# EAGLE design 1uO_c_v_1_3 (EAGLE 9.4.2)
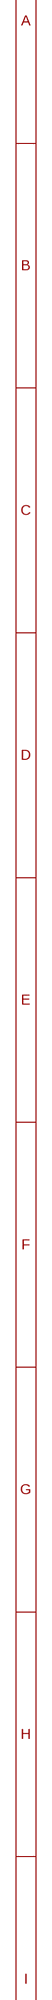
[diagram p0: schematic, sheet 1, part 1 of 2]
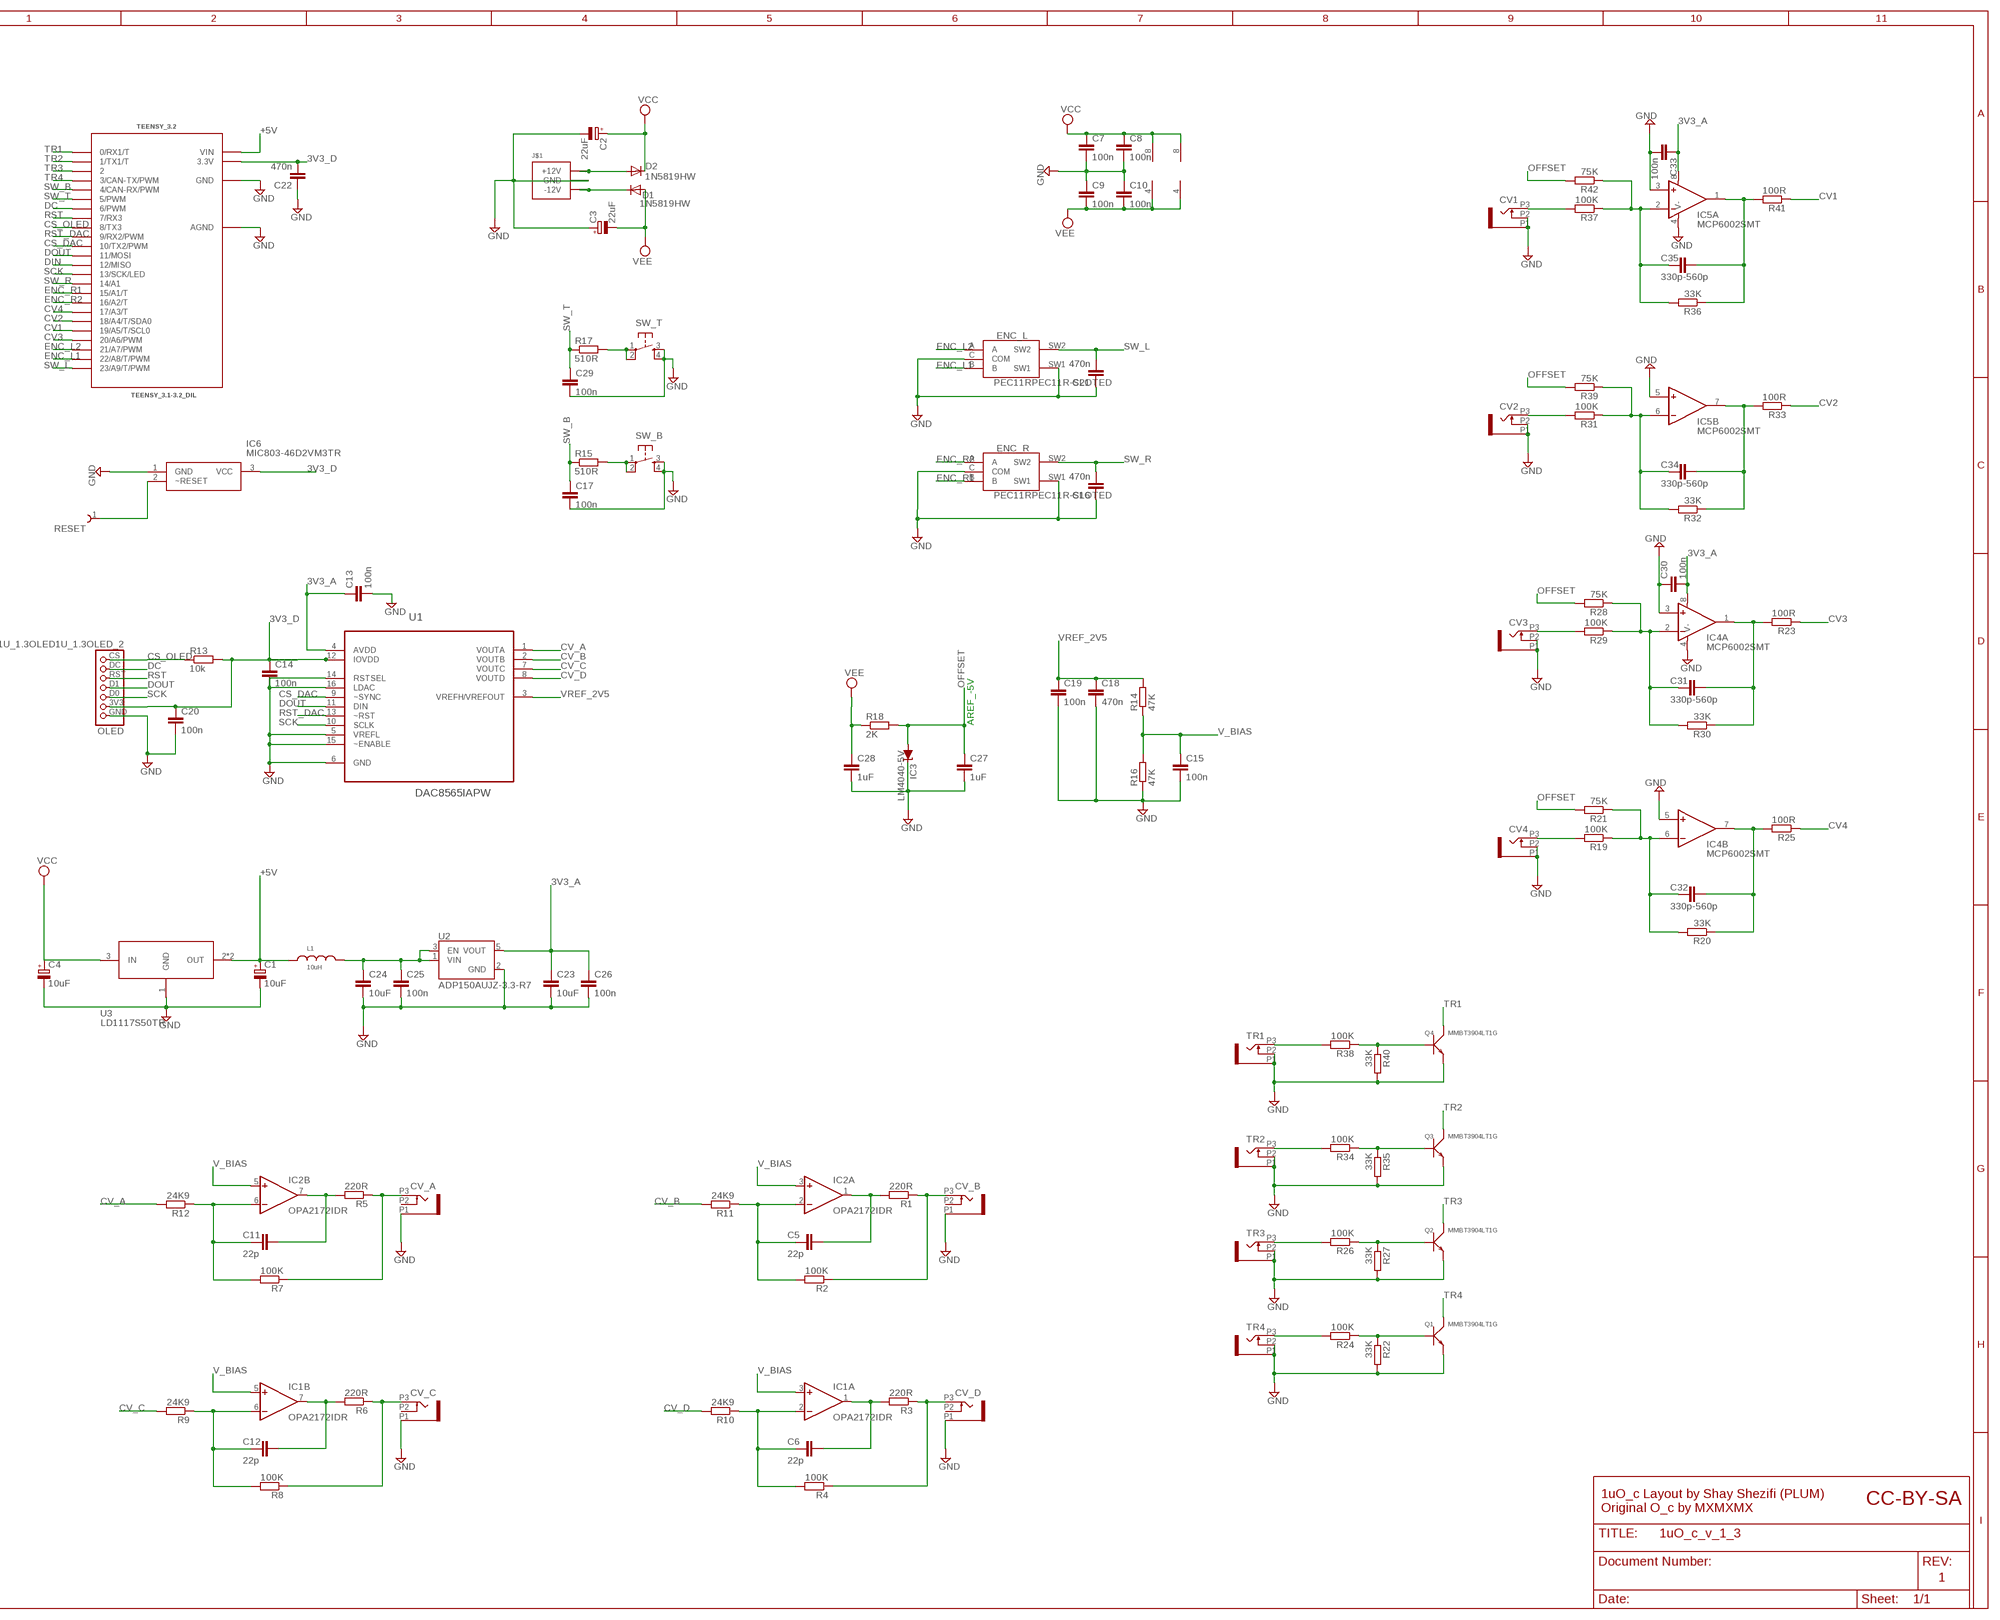
[diagram p1: schematic, sheet 1, part 2 of 2]

## Parts
C1  10uF  CPOL-EUB  [PANASONIC_B]
C2  22uF  CPOL-EUC  [PANASONIC_C]
C3  22uF  CPOL-EUC  [PANASONIC_C]
C4  10uF  CPOL-EUB  [PANASONIC_B]
C5  22p  C-EUC0603  [C0603]
C6  22p  C-EUC0603  [C0603]
C7  100n  C-EUC0603  [C0603]
C8  100n  C-EUC0603  [C0603]
C9  100n  C-EUC0603  [C0603]
C10  100n  C-EUC0603  [C0603]
C11  22p  C-EUC0603  [C0603]
C12  22p  C-EUC0603  [C0603]
C13  100n  C-EUC0603  [C0603]
C14  100n  C-EUC0603  [C0603]
C15  100n  C-EUC0603  [C0603]
C16  470n  C-EUC0603  [C0603]
C17  100n  C-EUC0603  [C0603]
C18  470n  C-EUC0603  [C0603]
C19  100n  C-EUC0603  [C0603]
C20  100n  C-EUC0603  [C0603]
C21  470n  C-EUC0603  [C0603]
C22  470n  C-EUC0603  [C0603]
C23  10uF  C-EUC1206K  [C1206K]
C24  10uF  C-EUC1206K  [C1206K]
C25  100n  C-EUC0603  [C0603]
C26  100n  C-EUC0603  [C0603]
C27  1uF  C-EUC0603  [C0603]
C28  1uF  C-EUC0603  [C0603]
C29  100n  C-EUC0603  [C0603]
C30  100n  C-EUC0603  [C0603]
C31  330p-560p  C-EUC0603  [C0603]
C32  330p-560p  C-EUC0603  [C0603]
C33  100n  C-EUC0603  [C0603]
C34  330p-560p  C-EUC0603  [C0603]
C35  330p-560p  C-EUC0603  [C0603]
CV1  OG-PJ301_PJ301_THONKICONN  [OG-PJ301_WQP_PJ_301M6_NO_HOLE]
CV2  OG-PJ301_PJ301_THONKICONN  [OG-PJ301_WQP_PJ_301M6_NO_HOLE]
CV3  OG-PJ301_PJ301_THONKICONN  [OG-PJ301_WQP_PJ_301M6_NO_HOLE]
CV4  OG-PJ301_PJ301_THONKICONN  [OG-PJ301_WQP_PJ_301M6_NO_HOLE]
CV_A  OG-PJ301_PJ301_THONKICONN  [OG-PJ301_WQP_PJ_301M6_NO_HOLE]
CV_B  OG-PJ301_PJ301_THONKICONN  [OG-PJ301_WQP_PJ_301M6_NO_HOLE]
CV_C  OG-PJ301_PJ301_THONKICONN  [OG-PJ301_WQP_PJ_301M6_NO_HOLE]
CV_D  OG-PJ301_PJ301_THONKICONN  [OG-PJ301_WQP_PJ_301M6_NO_HOLE]
D1  1N5819HW  DIODE_DIODE-SOD123  [DIODE_SOD123]
D2  1N5819HW  DIODE_DIODE-SOD123  [DIODE_SOD123]
ENC_L  PEC11RPEC11R-SLOTED  [PEC11R-SLOTED]
ENC_R  PEC11RPEC11R-SLOTED  [PEC11R-SLOTED]
IC1  OPA2172IDR  TL072D  [SO08]
IC2  OPA2172IDR  TL072D  [SO08]
IC3  LM4040-5V  LM4041B12DBZ  [DBZ_R-PDSO-G3]
IC4  MCP6002SMT  [SOIC8]
IC5  MCP6002SMT  [SOIC8]
IC6  MIC803-46D2VM3TR  [SOT95P230X110-3N]
J$1  POWER_SIMPLE10  [POWER_10]
L1  10uH  WE-LQ_1210_744032001  [WE-LQ_M]
OLED  1U_1.3OLED1U_1.3OLED_2  [1U_1.3OLED_2]
Q1  MMBT3904LT1G  SMD-TRANSISTORS-NPN-40V-200MA-MMBT3904LT1G(SOT-23)  [SOT-23]
Q2  MMBT3904LT1G  SMD-TRANSISTORS-NPN-40V-200MA-MMBT3904LT1G(SOT-23)  [SOT-23]
Q3  MMBT3904LT1G  SMD-TRANSISTORS-NPN-40V-200MA-MMBT3904LT1G(SOT-23)  [SOT-23]
Q4  MMBT3904LT1G  SMD-TRANSISTORS-NPN-40V-200MA-MMBT3904LT1G(SOT-23)  [SOT-23]
R1  220R  R-EU_R0603  [R0603]
R2  100K  R-EU_R0603  [R0603]
R3  220R  R-EU_R0603  [R0603]
R4  100K  R-EU_R0603  [R0603]
R5  220R  R-EU_R0603  [R0603]
R6  220R  R-EU_R0603  [R0603]
R7  100K  R-EU_R0603  [R0603]
R8  100K  R-EU_R0603  [R0603]
R9  24K9  R-EU_R0603  [R0603]
R10  24K9  R-EU_R0603  [R0603]
R11  24K9  R-EU_R0603  [R0603]
R12  24K9  R-EU_R0603  [R0603]
R13  10k  R-EU_R0603  [R0603]
R14  47K  R-EU_R0603  [R0603]
R15  510R  R-EU_R0603  [R0603]
R16  47K  R-EU_R0603  [R0603]
R17  510R  R-EU_R0603  [R0603]
R18  2K  R-EU_R0603  [R0603]
R19  100K  R-EU_R0603  [R0603]
R20  33K  R-EU_R0603  [R0603]
R21  75K  R-EU_R0603  [R0603]
R22  33K  R-EU_R0603  [R0603]
R23  100R  R-EU_R0603  [R0603]
R24  100K  R-EU_R0603  [R0603]
R25  100R  R-EU_R0603  [R0603]
R26  100K  R-EU_R0603  [R0603]
R27  33K  R-EU_R0603  [R0603]
R28  75K  R-EU_R0603  [R0603]
R29  100K  R-EU_R0603  [R0603]
R30  33K  R-EU_R0603  [R0603]
R31  100K  R-EU_R0603  [R0603]
R32  33K  R-EU_R0603  [R0603]
R33  100R  R-EU_R0603  [R0603]
R34  100K  R-EU_R0603  [R0603]
R35  33K  R-EU_R0603  [R0603]
R36  33K  R-EU_R0603  [R0603]
R37  100K  R-EU_R0603  [R0603]
R38  100K  R-EU_R0603  [R0603]
R39  75K  R-EU_R0603  [R0603]
R40  33K  R-EU_R0603  [R0603]
R41  100R  R-EU_R0603  [R0603]
R42  75K  R-EU_R0603  [R0603]
RESET  61300111121  [61300111121]
SW_B  TAC_SWITCHPTH  [TACTILE-PTH]
SW_T  TAC_SWITCHPTH  [TACTILE-PTH]
TEENSY_3.2  TEENSY_3.1-3.2_DIL  [TEENSY_3.0-3.2&LC_DIL]
TR1  OG-PJ301_PJ301_THONKICONN  [OG-PJ301_WQP_PJ_301M6_NO_HOLE]
TR2  OG-PJ301_PJ301_THONKICONN  [OG-PJ301_WQP_PJ_301M6_NO_HOLE]
TR3  OG-PJ301_PJ301_THONKICONN  [OG-PJ301_WQP_PJ_301M6_NO_HOLE]
TR4  OG-PJ301_PJ301_THONKICONN  [OG-PJ301_WQP_PJ_301M6_NO_HOLE]
U1  DAC8565IAPW  [SOP65P640X120-16N]
U2  ADP150AUJZ-3.3-R7  [SOT95P280X100-5N]
U3  LD1117S50TR  [SOT223]

## Nets
3V3_A: C13.1 C23.1 C26.1 C30.2 C33.1 IC4.8(A:V+) IC5.8(A:V+) U1.4(AVDD) U2.5(VOUT)
3V3_D: C14.1 C20.1 C22.2 IC6.3(VCC) OLED.3V3 R13.2 TEENSY_3.2.3.3V U1.12(IOVDD)
+5V: C1.+ L1.1 TEENSY_3.2.VIN U3.2(OUT) U3.4(OUT)
CS_DAC: TEENSY_3.2.10(10/TX2/PWM) U1.9(~SYNC)
CS_OLED: OLED.CS R13.1 TEENSY_3.2.8(8/TX3)
CV1: R41.1 TEENSY_3.2.19/A5(19/A5/T/SCL0)
CV2: R33.1 TEENSY_3.2.18/A4(18/A4/T/SDA0)
CV3: R23.1 TEENSY_3.2.20/A6(20/A6/PWM)
CV4: R25.1 TEENSY_3.2.17/A3(17/A3/T)
CV_A: R12.2 U1.1(VOUTA)
CV_B: R11.2 U1.2(VOUTB)
CV_C: R9.2 U1.7(VOUTC)
CV_D: R10.2 U1.8(VOUTD)
DC: OLED.DC TEENSY_3.2.6(6/PWM)
DIN: TEENSY_3.2.12(12/MISO)
DOUT: OLED.D1 TEENSY_3.2.11(11/MOSI) U1.11(DIN)
ENC_L1: ENC_L.B TEENSY_3.2.22/A8(22/A8/T/PWM)
ENC_L2: ENC_L.A TEENSY_3.2.21/A7(21/A7/PWM)
ENC_R1: ENC_R.B TEENSY_3.2.15/A1(15/A1/T)
ENC_R2: ENC_R.A TEENSY_3.2.16/A2(16/A2/T)
GND: C1.- C2.- C3.+ C4.- C7.2 C8.2 C9.1 C10.1 C13.2 C14.2 C15.2 C16.1 C17.2 C18.2 C19.2 C20.2 C21.1 C22.1 C23.2 C24.2 C25.2 C26.2 C27.2 C28.2 C29.2 C30.1 C33.2 CV1.P1 CV1.P2 CV2.P1 CV2.P2 CV3.P1 CV3.P2 CV4.P1 CV4.P2 CV_A.P1 CV_B.P1 CV_C.P1 CV_D.P1 ENC_L.C(COM) ENC_L.SW1 ENC_R.C(COM) ENC_R.SW1 IC3.1(C) IC4.3(A:+IN) IC4.4(A:V-) IC4.5(B:+IN) IC5.3(A:+IN) IC5.4(A:V-) IC5.5(B:+IN) IC6.1(GND) J$1.3(GND) J$1.4(GND) J$1.5(GND) J$1.6(GND) J$1.7(GND) J$1.8(GND) OLED.GND Q1.2(E) Q2.2(E) Q3.2(E) Q4.2(E) R16.1 R22.2 R27.2 R35.2 R40.2 SW_B.3 SW_B.4 SW_T.3 SW_T.4 TEENSY_3.2.AGND TEENSY_3.2.GND TR1.P1 TR1.P2 TR2.P1 TR2.P2 TR3.P1 TR3.P2 TR4.P1 TR4.P2 U1.5(VREFL) U1.6(GND) U1.14(RSTSEL) U1.15(~ENABLE) U1.16(LDAC) U2.2(GND) U3.1(GND)
N$1: D1.C J$1.1(-12V) J$1.2(-12V)
N$2: D2.A J$1.9(+12V) J$1.10(+12V)
N$3: C24.1 C25.1 L1.2 U2.1(VIN) U2.3(EN)
N$4: CV1.P3 R37.2
N$5: C35.2 IC5.2(A:-IN) R36.2 R37.1 R42.1
N$6: C35.1 IC5.1(A:OUT) R36.1 R41.2
N$7: R17.2 SW_T.1 SW_T.2
N$8: CV2.P3 R31.2
N$9: R15.2 SW_B.1 SW_B.2
N$10: C34.2 IC5.6(B:-IN) R31.1 R32.2 R39.1
N$11: C34.1 IC5.7(B:OUT) R32.1 R33.2
N$12: CV3.P3 R29.2
N$13: C31.2 IC4.2(A:-IN) R28.1 R29.1 R30.2
N$14: C31.1 IC4.1(A:OUT) R23.2 R30.1
N$15: CV4.P3 R19.2
N$16: C32.2 IC4.6(B:-IN) R19.1 R20.2 R21.1
N$17: C32.1 IC4.7(B:OUT) R20.1 R25.2
N$18: R38.2 TR1.P3
N$19: Q4.1(B) R38.1 R40.1
N$20: R34.2 TR2.P3
N$21: Q3.1(B) R34.1 R35.1
N$22: R26.2 TR3.P3
N$23: Q2.1(B) R26.1 R27.1
N$24: R24.2 TR4.P3
N$25: Q1.1(B) R22.1 R24.1
N$26: C5.2 IC2.2(A:-IN) R2.2 R11.1
N$27: C11.2 IC2.6(B:-IN) R7.2 R12.1
N$28: C11.1 IC2.7(B:OUT) R5.2
N$29: CV_A.P3 R5.1 R7.1
N$30: C5.1 IC2.1(A:OUT) R1.2
N$31: CV_B.P3 R1.1 R2.1
N$32: C12.2 IC1.6(B:-IN) R8.2 R9.1
N$33: C12.1 IC1.7(B:OUT) R6.2
N$34: CV_C.P3 R6.1 R8.1
N$35: C6.2 IC1.2(A:-IN) R4.2 R10.1
N$36: C6.1 IC1.1(A:OUT) R3.2
N$37: CV_D.P3 R3.1 R4.1
N$52: IC6.2(~RESET) RESET.1
OFFSET: C27.1 IC3.2(A) R18.2 R21.2 R28.2 R39.2 R42.2
RST: OLED.RST TEENSY_3.2.7(7/RX3)
RST_DAC: TEENSY_3.2.9(9/RX2/PWM) U1.13(~RST)
SCK: OLED.D0 TEENSY_3.2.13(13/SCK/LED) U1.10(SCLK)
SW_B: C17.1 R15.1 TEENSY_3.2.4(4/CAN-RX/PWM)
SW_L: C21.2 ENC_L.SW2 TEENSY_3.2.23/A9(23/A9/T/PWM)
SW_R: C16.2 ENC_R.SW2 TEENSY_3.2.14/A0(14/A1)
SW_T: C29.1 R17.1 TEENSY_3.2.5(5/PWM)
TR1: Q4.3(C) TEENSY_3.2.0(0/RX1/T)
TR2: Q3.3(C) TEENSY_3.2.1(1/TX1/T)
TR3: Q2.3(C) TEENSY_3.2.2
TR4: Q1.3(C) TEENSY_3.2.3(3/CAN-TX/PWM)
V_BIAS: C15.1 IC1.3(A:+IN) IC1.5(B:+IN) IC2.3(A:+IN) IC2.5(B:+IN) R14.1 R16.2
VCC: C2.+ C4.+ C7.1 C8.1 D2.C IC1.8(P:V+) IC2.8(P:V+) U3.3(IN)
VEE: C3.- C9.2 C10.2 C28.1 D1.A IC1.4(P:V-) IC2.4(P:V-) R18.1
VREF_2V5: C18.1 C19.1 R14.2 U1.3(VREFH/VREFOUT)
Unconnected: CV_A.P2 CV_B.P2 CV_C.P2 CV_D.P2

## Notes on the sheet
- AREF_-5V
- CC-BY-SA
- 1uO_c Layout by Shay Shezifi (PLUM)
  Original O_c by MXMXMX
- 1

## Library data of the parts
C1-C4 = rcl:CPOL-EU: POLARIZED CAPACITOR, European symbol; SPICEPREFIX: C
C5-C35 = resistor:C-EU: CAPACITOR, European symbol
CV1-CV4 CV_A CV_B CV_C CV_D TR1-TR4 = SHAY_THONKICONNS:OG-PJ301_PJ301_THONKICONN
D1 D2 = elements_v02:DIODE_DIODE-: DIODE
ENC_L ENC_R = PEC11R-4215K-S0024:PEC11R: Incremental encoder 24 detents 24 pulses Bourns 24 Pulse Incremental Mechanical Rotary Encoder with a 6 mm Flat Shaft (Not Indexed), Through Hole Source: Datasheet <http://uk.rs-online.com/web/p/products/7377742>
IC1 IC2 = linear:TL072: OP AMP
IC3 = texas:LM4041: PRECISION MICROPOWER SHUNT VOLTAGE REFERENCE Source: http://focus.ti.com/lit/ds/slcs146e/slcs146e.pdf
IC4 IC5 = EurorackModularParts:MCP6002: Dual General Op Amp 1.8V min supply 1MHz (6V/us)
IC6 = MIC803-46D2VM3TR:MIC803-46D2VM3TR: 3-pin Microprocessor Supervosor Circui Source: Datasheet; ARROW_PART_NUMBER: MIC803-46D2VM3TR; DESCRIPTION: 3-pin Microprocessor Supervosor Circui; HEIGHT: mm; MANUFACTURER_NAME: Micrel; MANUFACTURER_PART_NUMBER: MIC803-46D2VM3TR
J$1 = EurorackModularParts:POWER_SIMPLE
L1 = Wurth_Elektronik_Passive_rev17b:WE-LQ_1210: SMD Inductor Characteristics Miniature chip inductor wound on a special ferrite core Small inductances for compact circuits High Q at high frequencies Low DC-resistance Operating temperature: –40 ºC to +125 ºC Applications Low power DC/DC-converters from Linear Technology, National Semiconductor, Texas Instruments, Fairchild Semiconductor, ON Semiconductor, STMicroelectronics, Maxim, MPS, Semtech, Exar, Analogic Tech, Diodes and Cologne Chip EMI-Filtering RF-circuits <http://katalog.we-online.de/media/images/eisos/IndLQ_pf2.jpg> Details see: http://katalog.we-online.de/en/pbs/WE-LQ? Updated by Dan Xu 2014-07-08 2014 (C) Wurth Elektronik; WE-NUMBER: 744032001/1uH
OLED = 1U_1.3oled:1U_1.3OLED
Q1-Q4 = Seeed-Transistor:SMD-TRANSISTORS-NPN-40V-200MA-MMBT3904LT1G(SOT-23): 305010013; MPN: MMBT3904LT1G
R1-R42 = rcl:R-EU_: RESISTOR, European symbol; SPICEPREFIX: R
RESET = Wurth_Elektronik_Electromechanic_Board_to_Board_Connectors_rev17a:61300111121: WR-PHD 2.54 mm Pin Header, 1Pin=>Code : Con_BTB_PHD_2.54_1_THT_61300111121 <http://katalog.we-online.de/media/images/eican/Con_BTB_PHD_2.54_1_THT_6130xx11121_pf2.jpg> Details see: http://katalog.we-online.de/en/em/613_0xx_111_21 Created 2014-05-29, Karrer Zheng 2014 (C) Würth Elektronik
SW_B SW_T = SparkFun:TAC_SWITCH: Momentary Switch Button commonly used for reset or general input. Spark Fun Electronics SKU : COM-00097
TEENSY_3.2 = Teensy_3_and_LC_Series_Boards_v1.4:TEENSY_3.1-3.2_DIL: Teensy 3.1 or 3.2 in a DIL Layout.
U1 = DAC8565IAPW:DAC8565IAPW: Quad Channel DAC; AVAILABILITY: Good; DESCRIPTION: 16-Bit, Quad Channel, Ultra-Low Glitch, Voltage Output DAC with 2.5V, 2ppm/C Internal eference 16-TSSOP -40 to 105; MF: Texas Instruments; MP: DAC8565IAPW; PACKAGE: TSSOP-16 Texas Instruments; PRICE: 10.78 USD
U2 = ADP150AUJZ-2.3-R7:ADP150AUJZ-3.3-R7: IC REG LINEAR 2V 150MA 5TSOT; AVAILABILITY: Good; DESCRIPTION: LDO Regulator Pos 2V 0.15A 5-Pin TSOT T/R; MF: Analog Devices; MP: ADP150AUJZ-2.0-R7; PACKAGE: TSOT-23 Analog Devices; PRICE: 0.65 USD
U3 = LD1117S50TR:LD1117S50TR: http://octopart.com/ld1117s50tr-stmicroelectronics-529395; AVAILABILITY: Good; DESCRIPTION: LD1117 Series 1300 mA 5 V Fixed Output Positive Voltage LDO Regulator - SOT-223; MF: STMicroelectronics; MP: LD1117S50TR; PACKAGE: SOT-223 STMicroelectronics; PRICE: 0.19 USD

## Board
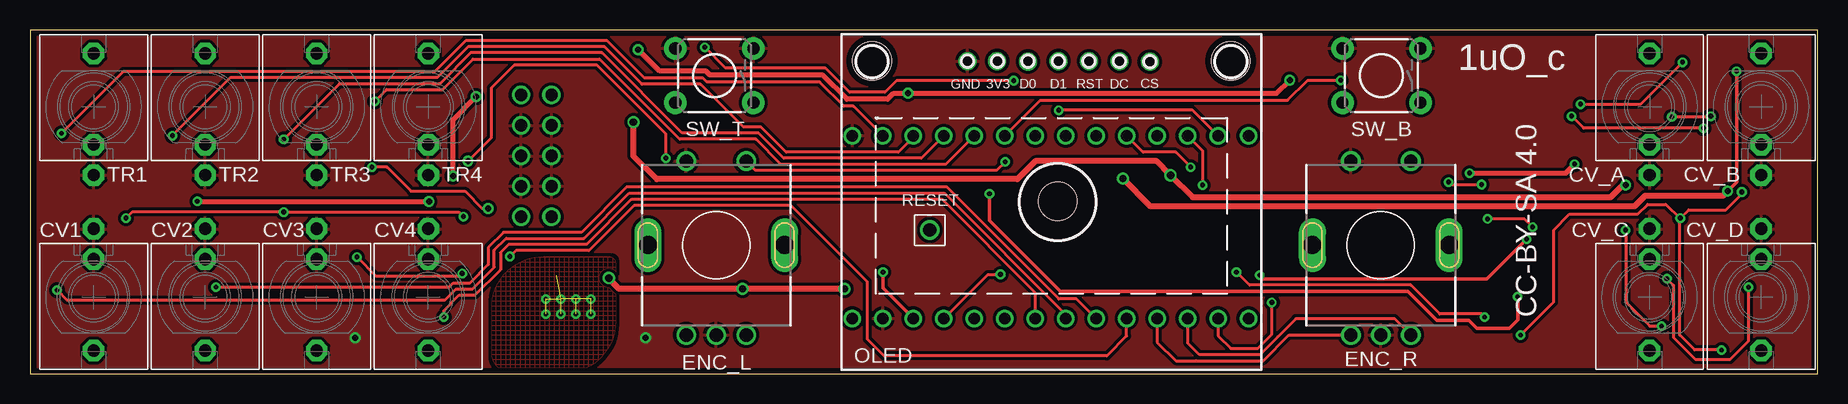
[diagram p2: board, top side]
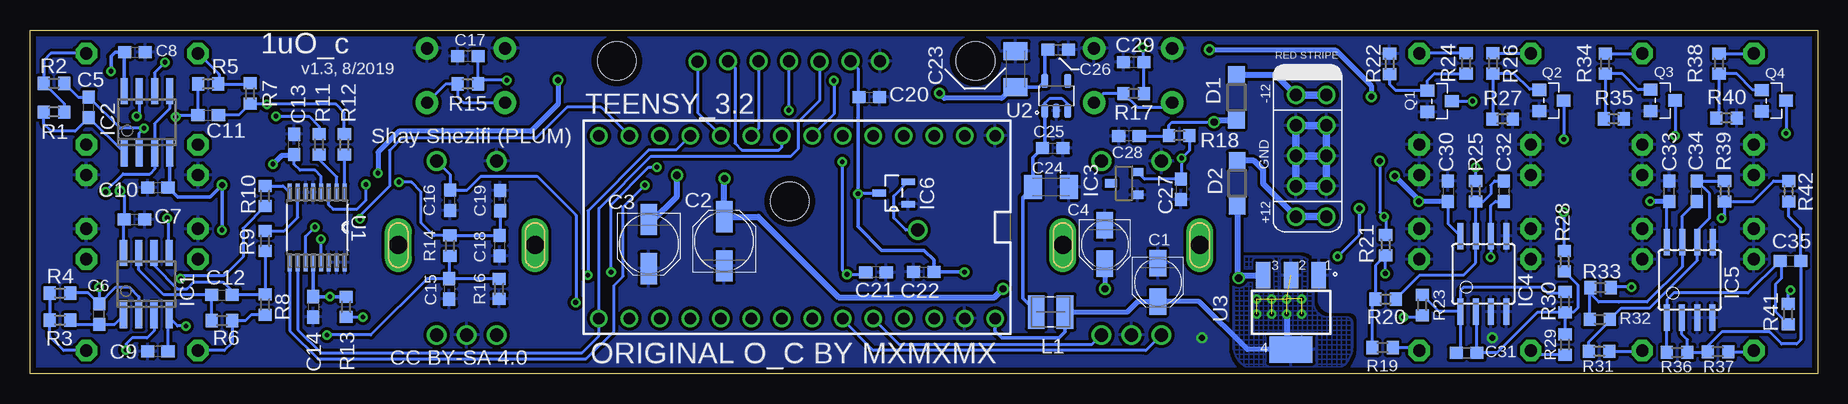
[diagram p3: board, bottom side, seen from below]

Size 149 x 28.7 mm. Coordinates in mm from the lower left corner, seen from the top.
Outline: 0,0 149,0 149,28.7 0,28.7 0,0
Copper layers (1*16): Top 0.035mm / dielectric 1.5mm / Bottom 0.035mm
Design rules "default *": minimum track width 6mil, minimum drill 0.4mm, track to track 10mil, track to pad 10mil, pad to pad 10mil, via to via 10mil, smd to smd 7mil, copper to edge 20mil, drill to drill 8mil, minimum pad ring 10mil, minimum via ring 8mil, stop-mask expansion 10mil, vias tented up to drill 25mil, thermal gap 10mil

### Footprints (pad centres in the part's own frame; a part is rotated, then mirrored left to right if it is on the bottom)
PANASONIC_B = smd 2.2 x 1.4: + 1.6,0; - -1.6,0
PANASONIC_C = smd 2.6 x 1.4: + 2.05,0; - -2.05,0
C0603 = smd 1.1 x 1: 1 -0.85,0; 2 0.85,0
C1206K = smd 1.5 x 2: 1 -1.5,0; 2 1.5,0
OG-PJ301_WQP_PJ_301M6_NO_HOLE = drill 1.016 pad 1.778 octagon: P1 0,-5.715; P2 0,-3.175; P3 0,4.445
DIODE_SOD123 = smd 1.4 x 1.4: A 1.9,0; C -1.9,0
PEC11R-SLOTED = drill 1.1 pad 1.65: A -2.5,-7.5; B 2.5,-7.5; C 0,-7.5; SW1 -2.5,7; SW2 2.5,7 | drill 1.5 long: SH1 -5.7,0; SH2 5.7,0
SO08 = smd 0.6 x 2.2: 1 -1.905,-2.6; 2 -0.635,-2.6; 3 0.635,-2.6; 4 1.905,-2.6; 5 1.905,2.6; 6 0.635,2.6; 7 -0.635,2.6; 8 -1.905,2.6
DBZ_R-PDSO-G3 = smd 0.7 x 1: 1 -0.95,-1.1; 2 0.95,-1.1; 3 0,1.1
SOIC8 = smd 0.5 x 2.2: 1 -1.905,-3.154; 2 -0.645,-3.154; 3 0.625,-3.154; 4 1.895,-3.154; 5 1.905,3.154; 6 0.635,3.154; 7 -0.635,3.154; 8 -1.905,3.154
SOT95P230X110-3N = smd 1.118 x 0.559: 1 -1.194,0.94; 2 -1.194,-0.94; 3 1.194,0
POWER_10 = drill 1.016: 1 -5.08,-1.27; 2 -5.08,1.27; 3 -2.54,-1.27; 4 -2.54,1.27; 5 0,-1.27; 6 0,1.27; 7 2.54,-1.27; 8 2.54,1.27; 9 5.08,-1.27; 10 5.08,1.27
WE-LQ_M = smd 1.4 x 2.8: 1 -1.2,0; 2 1.2,0
1U_1.3OLED_2 = drill 1: 3V3 -5.06,11.69; CS 7.66,11.64; D0 -2.48,11.65; D1 0.05,11.69; DC 5.13,11.68; GND -7.54,11.69; RST 2.58,11.67 | hole 3.2: 0,0; -15.494,11.684; 14.406,11.684
SOT-23 = smd 1.016 x 1.143: 1 -0.889,-1.016; 2 0.889,-1.016; 3 0,1.016
R0603 = smd 1 x 1.1: 1 -0.85,0; 2 0.85,0
61300111121 = drill 1.1: 1 0,0
TACTILE-PTH = drill 1.016 pad 1.88: 1 -3.251,2.261; 2 3.251,2.261; 3 -3.251,-2.261; 4 3.251,-2.261
TEENSY_3.0-3.2&LC_DIL = drill 0.965: 0 -7.62,13.97; 1 -7.62,11.43; 2 -7.62,8.89; 3 -7.62,6.35; 3.3V 7.62,11.43; 4 -7.62,3.81; 5 -7.62,1.27; 6 -7.62,-1.27; 7 -7.62,-3.81; 8 -7.62,-6.35; 9 -7.62,-8.89; 10 -7.62,-11.43; 11 -7.62,-13.97; 12 -7.62,-16.51; 13 7.62,-16.51; 14/A0 7.62,-13.97; 15/A1 7.62,-11.43; 16/A2 7.62,-8.89; 17/A3 7.62,-6.35; 18/A4 7.62,-3.81; 19/A5 7.62,-1.27; 20/A6 7.62,1.27; 21/A7 7.62,3.81; 22/A8 7.62,6.35; 23/A9 7.62,8.89; AGND 7.62,13.97; GND -7.62,16.51; VIN 7.62,16.51
SOP65P640X120-16N = smd 1.473 x 0.356: 1 -2.921,2.286; 2 -2.921,1.626; 3 -2.921,0.965; 4 -2.921,0.33; 5 -2.921,-0.33; 6 -2.921,-0.965; 7 -2.921,-1.626; 8 -2.921,-2.286; 9 2.921,-2.286; 10 2.921,-1.626; 11 2.921,-0.965; 12 2.921,-0.33; 13 2.921,0.33; 14 2.921,0.965; 15 2.921,1.626; 16 2.921,2.286
SOT95P280X100-5N = smd 1.14 x 0.59: 1 -1.245,0.95; 2 -1.245,0; 3 -1.245,-0.95; 4 1.245,-0.95; 5 1.245,0.95
SOT223 = smd 2.235 x 1.219: 1 -3.099,2.311; 2 -3.099,0; 3 -3.099,-2.311 | smd 2.2 x 3.6: 4 3.099,0

### Placement (x,y rotation side)
C1  54.99,7.65 270 bottom
C2  91.13,11.06 90 bottom
C3  97.42,10.84 270 bottom
C4  59.41,10.8 270 bottom
C5  144.1,22.25 90 bottom
C6  143.25,5 90 bottom
C7  140.3,12.9 0 bottom
C8  140.25,26.85 0 bottom
C9  138.35,1.9 0 bottom
C10  138.35,15.55 0 bottom
C11  134.15,21.6 0 bottom
C12  133,6.6 0 bottom
C13  126.99,19.15 90 bottom
C14  125.38,5.6 270 bottom
C15  114.05,7.1 270 bottom
C16  114,14.5 90 bottom
C17  112.5,26.5 180 bottom
C18  109.85,10.7 270 bottom
C19  109.82,14.46 90 bottom
C20  79.04,23.08 0 bottom
C21  78.48,8.49 180 bottom
C22  74.5,8.51 0 bottom
C23  66.85,25.45 90 bottom
C24  63.9,15.6 0 bottom
C25  63.75,18.85 0 bottom
C26  63.3,27.05 0 bottom
C27  53.05,15.4 270 bottom
C28  57.4,19.85 180 bottom
C29  57,26 180 bottom
C30  30.8,15.25 270 bottom
C31  29.25,1.75 0 bottom
C32  26.15,15.25 270 bottom
C33  12.35,15.25 90 bottom
C34  10.05,15.25 90 bottom
C35  2.25,9.45 0 bottom
CV1  5.3,6.4 180 top
CV2  14.6,6.4 180 top
CV3  23.9,6.4 180 top
CV4  33.2,6.4 180 top
CV_A  135,22.3 0 top
CV_B  144.3,22.3 0 top
CV_C  135,6.4 180 top
CV_D  144.3,6.4 180 top
D1  48.43,23.09 270 bottom
D2  48.37,15.9 90 bottom
ENC_L  57.2,10.75 0 top
ENC_R  112.6,10.75 0 top
IC1  139.3,7.5 0 bottom
IC2  139.25,21 0 bottom
IC3  57.8,15.9 90 bottom
IC4  27.85,8.35 0 bottom
IC5  10.65,7.85 0 bottom
IC6  77,15.1 180 bottom
J$1  42.2,18.2 270 bottom
L1  63.92,5.17 180 bottom
OLED  85.68,14.42 0 top
Q1  31.5,22.75 270 bottom
Q2  22.18,22.81 270 bottom
Q3  12.89,22.82 270 bottom
Q4  3.63,22.8 270 bottom
R1  147,21.85 180 bottom
R2  147,24.25 0 bottom
R3  146.5,4.5 0 bottom
R4  146.5,6.75 0 bottom
R5  134.15,24.2 180 bottom
R6  133,4.45 180 bottom
R7  130.65,23.4 270 bottom
R8  129.4,5.8 90 bottom
R9  129.4,11.1 90 bottom
R10  129.4,14.85 90 bottom
R11  124.9,19.15 270 bottom
R12  122.8,19.15 270 bottom
R13  122.65,5.6 90 bottom
R14  114,10.7 90 bottom
R15  112.5,24.2 180 bottom
R16  109.9,7.1 90 bottom
R17  57,23.4 180 bottom
R18  53.2,19.9 0 bottom
R19  36.25,2.2 0 bottom
R20  36,6.25 180 bottom
R21  36,10.75 90 bottom
R22  35.67,25.88 90 bottom
R23  32.95,5.75 90 bottom
R24  29.29,25.92 90 bottom
R25  28.5,15.25 270 bottom
R26  27.06,25.92 90 bottom
R27  26.26,21.27 0 bottom
R28  21.1,9.4 90 bottom
R29  21.05,2.45 270 bottom
R30  21.05,6 270 bottom
R31  18.2,1.9 0 bottom
R32  18.15,4.55 0 bottom
R33  18.1,7.2 180 bottom
R34  17.69,25.89 90 bottom
R35  16.98,21.29 0 bottom
R36  11.7,1.8 0 bottom
R37  8.3,1.85 0 bottom
R38  8.21,25.89 90 bottom
R39  7.75,15.25 270 bottom
R40  7.6,21.35 0 bottom
R41  2.45,5 270 bottom
R42  2.4,15.25 90 bottom
RESET  75,12 0 top
SW_B  112.65,24.9 180 top
SW_T  57.05,24.9 180 top
TEENSY_3.2  85.06,12.25 270 bottom
TR1  5.3,22.3 0 top
TR2  14.6,22.3 0 top
TR3  23.9,22.3 0 top
TR4  33.2,22.3 0 top
U1  125.06,12.22 270 bottom
U2  63.45,23.2 90 bottom
U3  43.89,5.14 270 bottom

### Tracks (layer width: path | path; a pad name or v marks a point on that pad's centre or on a via)
3V3_A  (via drill 0.4, 0.5)
  Top 0.406: v13.95,14.4 v33.25,14.4 | v120,16.75 128,16.75 v128.75,17.5 | v105,24.5 103.92,23.42 v73.2,23.42 71.99,23.42 71.49,22.92 68.08,22.92 66.06,24.94 56.67,24.94 56.34,25.27 52.48,25.27 v50.7,27.05 | v35.25,16.5 35.25,21.2 v37.2,23.15
  Bottom 0.254: C30.2 30.8,12.55 IC4.8 | IC5.8 12.55,14.2 C33.1 | U1.4 124.73,16.48 125.25,17 126.5,17 126.99,17.49 126.99,18.25 C13.1
  Bottom 0.305: C26.1 64.4,26.8 U2.5 64.89,23.95 C23.1
  Bottom 0.406: C33.1 v13.95,14.4 | v105,24.5 105,22.5 107.25,20.25 118.25,20.25 120,18.5 v120,16.75 | v128.75,17.5 128,18.25 126.99,18.25 | C30.2 v33.25,14.4 33.25,14.5 v35.25,16.5 | C23.1 67.05,23.95 68,23 72.78,23 v73.2,23.42 | v50.7,27.05 40.2,27.05 37.2,24.05 v37.2,23.15
3V3_D  (via drill 0.4)
  Top 0.305: v124,6.45 124,4.5 123.3,3.8 120.6,3.8 119.93,4.47 117.28,4.47 114.87,6.88 85.9,6.88 79.97,12.8 v79.97,15.03 | TEENSY_3.2.3.3V 71.1,7.16 v71.1,8.5
  Bottom 0.254: 125.38,9.29 U1.12 | 125.25,6.45 C14.1 | OLED.3V3 80,25.49 80,22.97 | IC6.3 78.23,15.06 80,15.06
  Bottom 0.305: C14.1 125.38,9.29 | R13.2 v124,6.45 125.25,6.45 | C20.1 80,22.97 80,15.06 | 80,15.06 v79.97,15.03 | 71,8.6 v71.1,8.5 v71.11,8.51 C22.2 73.65,9.5 74.47,10.32 78.03,10.32 80,12.3 80,15.06
+5V  (via drill 0.4)  (8 unrouted)
  Bottom 0.305: TEENSY_3.2.VIN 68.55,3.55 68,3 63.25,3 62.72,3.53 L1.1
  Bottom 0.406: U3.4 44,2.04 47.54,2.04 51.55,6.05 C1.+ | 55.34,5.17 C1.+ | L1.1 57.53,5.17 56.65,6.05 C1.+
  Bottom 0.508: v44.25,5 44.25,2.29 44,2.04 | 43,2.93 U3.4
  other vias: 46.75,6.25 45.5,6.25 44.25,6.25 43,6.25 46.75,5 45.5,5 43,5
  pour Bottom (hatched): 48.75,8.7 48.75,2.5 arc-90 46.5,0.25 40.75,0.25 arc-90 38.75,2.25 38.75,4.25 arc-90 39.25,4.75 40.75,4.75 arc90 42,6 42,8.5 arc-90 43.35,9.85 47.6,9.85 arc-90
  pour Top (hatched): 48.8,9.2 48.8,4.4 arc-90 44.4,0 40.3,0 arc-90 38.5,1.8 38.5,5.5 arc-90 42.8,9.8 48.2,9.8 arc-90
CS_DAC  (via drill 0.4)
  Top 0.254: v97.75,15.75 97.75,18.61 TEENSY_3.2.10
  Bottom 0.254: U1.9 127.35,3.6 125,1.25 124.97,1.25 124.96,1.24 102.66,1.24 100.33,3.57 100.33,7.37 99.55,8.15 99.55,13.95 v97.75,15.75
CS_OLED  (via drill 0.4)
  Top 0.254: v96.75,17.25 95.5,18.5 92.78,18.5 TEENSY_3.2.8 | v121.25,4.75 121,5 117.5,5 115.09,7.41 101.65,7.41 v100.56,8.5
  Bottom 0.254: OLED.CS 93.34,21.8 TEENSY_3.2.8 | R13.1 v121.25,4.75 | v100.56,8.5 100.56,14.12 97.42,17.25 v96.75,17.25
CV1  (via drill 0.4)
  Top 0.254: TEENSY_3.2.19/A5 86.33,4.97 76.21,15.09 49.95,15.09 46.18,11.32 39.69,11.32 38.71,10.34 38.71,8.91 36.89,7.09 35.5,7.09 34.61,6.2 3.05,6.2 v2.25,7
  Bottom 0.254: R41.1 2.45,6.8 v2.25,7
CV2  (via drill 0.4)
  Top 0.254: v15.5,7.25 34.94,7.25 35.29,7.6 36.68,7.6 38.2,9.12 38.2,10.55 39.48,11.82 45.97,11.82 49.74,15.6 76.42,15.6 85.76,6.26 87.24,6.26 TEENSY_3.2.18/A4
  Bottom 0.254: v15.5,7.25 17.2,7.25 R33.1
CV3  (via drill 0.4)
  Top 0.254: v34.5,4.75 34.5,5.3 35.78,6.58 37.1,6.58 39.22,8.7 39.22,10.12 39.9,10.81 46.39,10.81 50.16,14.58 76,14.58 83.79,6.79 TEENSY_3.2.20/A6
  Bottom 0.254: v34.5,4.75 33.1,4.75 R23.1
CV4  (via drill 0.4, 0.5)
  Top 0.254: TEENSY_3.2.17/A3 91.41,3.16 89.75,1.5 71.2,1.5 69.8,2.9 69.8,7.7 63.42,14.07 50.38,14.07 46.6,10.3 40.5,10.3 v40,9.8 | v28.5,17.25 29.75,17.25 31.75,15.25 36.25,15.25 37.7,13.8 v38.2,13.8
  Bottom 0.254: R25.1 v28.5,17.25 | 38.2,11.8 v38.2,13.8 38.2,11.6 v40,9.8
CV_A
  Bottom 0.254: U1.1 122.77,18.27 R12.2
CV_B
  Bottom 0.254: U1.2 123.43,16.43 124.9,17.9 R11.2
CV_C
  Bottom 0.254: R9.2 127.8,11.95 126.69,13.06 U1.7
CV_D
  Bottom 0.254: R10.2 127.91,15.7 U1.8
DC
  Bottom 0.254: OLED.DC 90.25,25.54 90.25,19.25 89.68,18.68 86.57,18.68 86.33,18.92 TEENSY_3.2.6
DOUT  (via drill 0.4)
  Top 0.254: v125.25,12.25 124.56,12.94 v121.5,12.94 | TEENSY_3.2.11 96.9,22 v85.75,22
  Bottom 0.254: U1.11 126.03,11.47 v125.25,12.25 | TEENSY_3.2.11 101.41,22.25 104.24,22.25 106.83,19.67 118.01,19.67 119.03,18.64 119.03,15.68 121.5,13.21 v121.5,12.94 | v85.75,22 85.73,22.02 OLED.D1
ENC_L1
  Bottom 0.254: ENC_L.B 60.48,2.47 76.55,2.47 TEENSY_3.2.22/A8
ENC_L2
  Bottom 0.254: TEENSY_3.2.21/A7 81.25,4.5 78.71,1.96 55.99,1.96 ENC_L.A
ENC_R1
  Top 0.254: TEENSY_3.2.15/A1 96.49,2.61 97.49,1.61 102.53,1.61 104.01,3.09 104.01,3.11 105.5,4.6 113.75,4.6 ENC_R.B
ENC_R2
  Top 0.254: TEENSY_3.2.16/A2 93.95,2.65 95.5,1.1 97.2,1.1 102.8,1.1 104.95,3.25 ENC_R.A
GND  (via drill 0.5)
  Bottom 0.61: J$1.5 J$1.3 J$1.4 J$1.6 | J$1.5 J$1.6 | J$1.6 J$1.8 J$1.7 J$1.5
  other vias: 51.3,3 27.1,3
  pour Top (rank 3): 0,29 149,29 149,0 0,0
  pour Bottom (rank 3): 0,29 149,29 149,0 0,0
N$1
  Bottom 0.508: D1.C 45.18,24.99 J$1.1
  Bottom 0.61: J$1.1 J$1.2
N$2
  Bottom 0.508: J$1.9 46.2,15.85 46.2,17 47,17.8 D2.A
  Bottom 0.61: J$1.9 J$1.10
N$3
  Bottom 0.254: U2.1 64.4,22.6 64,23 63,23 62.5,22.5 U2.3
  Bottom 0.305: U2.1 64.4,19.05 C25.1 65.4,18.05 C24.1 66.25,14.75 66.25,6.3 L1.2
N$4
  Bottom 0.254: R37.2 5.4,1.85 CV1.P3
N$5
  Bottom 0.254: IC5.2 11.29,3.29 10.85,2.85 R36.2 9.2,1.8 | 9.2,1.8 R37.1 | 9.2,1.8 9.2,2.3 8,3.5 4,3.5 3,2.5 1.75,2.5 1.4,2.85 C35.2 1.4,12.15 2.4,13.15 R42.1
N$6
  Bottom 0.254: R36.1 IC5.1 12.55,6.2 12,6.75 5.8,6.75 C35.1 3,9.35 3,8 3.5,7.5 3.5,5.2 R41.2
N$7
  Bottom 0.254: SW_T.1 59.54,23.4 R17.2 56.7,22.25 54.19,22.25 SW_T.2
N$8
  Bottom 0.254: R31.2 14.66,1.9 CV2.P3
N$9
  Bottom 0.254: SW_B.1 114.34,24.2 R15.2 113.35,23.1 112.89,22.64 SW_B.2
N$10
  Bottom 0.254: IC5.6 10.02,11.25 | 10.02,11.25 10.02,11.98 9,13 9,15.05 C34.2 R39.1 | R31.1 19.05,2.7 17.3,4.45 R32.2 16.35,5.5 14,5.5 12.25,7.25 10.02,9.48 10.02,11.25
N$11
  Bottom 0.254: C34.1 11.29,13.16 IC5.7 11.29,8.93 14.21,6.01 16.56,6.01 16.57,6 18.25,6 19,6.75 | R32.1 19,6.75 | 19,6.75 19,7.15 R33.2
N$12
  Bottom 0.254: R29.2 23.55,1.6 CV3.P3
N$13
  Bottom 0.254: R30.2 R29.1 | IC4.2 28.4,5.1 C31.2 26.75,1.75 23.35,5.15 R30.2 | R28.1 20,7.45 20,5.5 20.35,5.15 R30.2
N$14
  Bottom 0.254: R23.2 31.6,5.25 29.81,5.25 IC4.1 | R30.1 21.15,6.75 22.5,6.75 23,7.25 29.5,7.25 29.76,7 IC4.1 | IC4.1 29.76,2.1 C31.1
N$15
  Bottom 0.254: CV4.P3 33.45,2.2 R19.2
N$16  (via drill 0.4)
  Top 0.254: v27.25,9.75 28.8,8.2 35.85,8.2 v36.03,8.38
  Bottom 0.254: R19.1 37.1,6 R20.2 36.85,7.1 36.85,7.6 36.85,9.05 R21.1 36.03,9.87 v36.03,8.38 | v27.25,9.75 27.25,11.47 IC4.6 27.21,14.04 26.85,14.4 C32.2
N$17
  Bottom 0.254: 28.48,14.38 IC4.7 28.48,9.27 29.5,8.25 33.15,8.25 R20.1 | 28.48,14.38 R25.2 | 28.48,14.38 27.86,14.38 27.25,15 27.25,15.75 26.9,16.1 C32.1
N$18
  Bottom 0.254: R38.2 TR1.P3
N$19
  Bottom 0.254: R40.1 8.21,21.59 R38.1 6.75,25.04 5.4,23.69 Q4.1
N$20
  Bottom 0.254: R34.2 TR2.P3
N$21
  Bottom 0.254: R35.1 17.69,21.43 R34.1 16.29,25.04 14.96,23.71 Q3.1
N$22
  Bottom 0.254: R26.2 27.04,26.75 TR3.P3
N$23
  Bottom 0.254: R26.1 27.03,25.07 26.82,25.28 | Q2.1 23.25,23.75 24,23.75 25.32,25.07 R26.1 | R26.1 27.06,21.32 R27.1
N$24
  Bottom 0.254: R24.2 33.17,26.77 TR4.P3
N$25
  Bottom 0.254: 28.89,25.27 R24.1 31.93,25.07 32.52,24.48 Q1.1 35.14,23.64 35.67,24.17 R22.1
N$26  (via drill 0.4)
  Top 0.254: v128.5,21.5 129.5,20.5 v139.5,20.5
  Bottom 0.254: R2.2 145,23.1 C5.2 141.5,20.5 v139.5,20.5 139.88,20.11 IC2.2 | R11.1 124.9,20.65 125.75,21.5 v128.5,21.5
N$27  (via drill 0.4)
  Top 0.254: v137.75,26 134.25,22.5 v129.25,22.5
  Bottom 0.254: C11.2 131.6,21.6 R7.2 129.3,22.55 v129.25,22.5 123.5,22.5 122.8,21.8 R12.1 | v137.75,26 138.62,25.14 IC2.6
N$28  (via drill 0.4)
  Top 0.254: v140.1,21.5 140.05,21.45 v136.85,21.45
  Bottom 0.254: IC2.7 139.88,21.71 v140.1,21.5 | v136.85,21.45 136.7,21.6 C11.1 R5.2
N$29
  Bottom 0.254: R5.1 133.25,24.2 | 133.25,24.2 130.7,24.2 R7.1 | CV_A.P3 133.25,25 133.25,24.2
N$30
  Bottom 0.254: R1.2 147.85,20.85 147.25,20.25 145.25,20.25 C5.1 141.16,18.45 IC2.1
N$31
  Bottom 0.254: CV_B.P3 147.25,26.75 147.85,26.15 R2.1 146.15,22.55 R1.1
N$32
  Bottom 0.254: C12.2 132.12,6.62 | 132.12,6.62 132.1,6.65 R8.2 R9.1 | IC1.6 138.66,9.06 136.72,7.11 135.9,7.11 135.33,7.67 132.9,7.67 132.12,6.9 132.12,6.62
N$33
  Bottom 0.254: R6.2 C12.1 137.85,6.6 139.94,8.69 IC1.7
N$34
  Bottom 0.254: CV_C.P3 132.79,1.96 132.15,2.6 R6.1 131.05,4.45 130.55,4.95 R8.1
N$35  (via drill 0.4)
  Top 0.254: v143.25,7.25 143.25,2.75 141.72,1.22 138.82,1.22 136.99,3.04 136.99,7.41 v136.45,7.95
  Bottom 0.254: C6.2 141.85,7.25 140.75,7.25 139.94,6.43 IC1.2 | C6.2 144.15,6.75 R4.2 | R10.1 131.25,12.15 131.25,9.75 132.82,8.18 136.22,8.18 v136.45,7.95 | v143.25,7.25 C6.2
N$36
  Bottom 0.254: R3.2 145.3,4.15 C6.1 141.96,4.15 IC1.1
N$37
  Bottom 0.254: CV_D.P3 146.21,1.96 147.35,3.1 R3.1 R4.1
N$52
  Bottom 0.254: IC6.2 77,14.85 77,13 76,12 RESET.1
OFFSET  (via drill 0.4, 0.5)
  Top 0.254: v8,13 8.5,13.5 v21.15,13.5 35.75,13.5 v36.12,13.12 | v53,18 53,20.03 47.26,25.77 40.37,25.77 38.45,23.85 38.45,19.7 v36.5,17.75
  Bottom 0.254: R42.2 3.65,16.1 5.35,14.4 R39.2 7.75,13.25 v8,13 | R28.2 21.1,13.45 v21.15,13.5 | R21.2 36,13 v36.12,13.12 36.5,13.5 v36.5,17.75 | R18.2 52.35,18.65 v53,18 53,16.3 C27.1 56.1,16.25 IC3.2
RST
  Bottom 0.254: OLED.RST 88.26,20.48 TEENSY_3.2.7
RST_DAC  (via drill 0.4)
  Top 0.305: v124.75,11.25 121.44,7.94 102.81,7.94 v102.5,8.25
  Bottom 0.254: TEENSY_3.2.9 95.14,18.68 97.43,18.68 102.5,13.61 v102.5,8.25 | 124.75,9.32 U1.13 124.73,11.23 v124.75,11.25
SCK
  Bottom 0.254: OLED.D0 83.2,22.8 85,21 85,18.75 85.38,18.38 | 85.38,18.38 85.5,18.25 | U1.10 126.69,3.69 124.75,1.75 103,1.75 101.57,3.18 TEENSY_3.2.13 101.57,13.82 97.22,18.17 85.58,18.17 85.38,18.38
SW_B  (via drill 0.4)
  Top 0.254: TEENSY_3.2.4 84.21,22.83 104.83,22.83 106.5,24.5 v109.25,24.5
  Bottom 0.254: v109.25,24.5 111.35,24.5 R15.1 C17.1
SW_L  (via drill 0.4)
  Top 0.254: TEENSY_3.2.23/A9 79.84,8.3 v80.9,8.3 | v81.3,17.7 80.58,16.98 60.47,16.98 ENC_L.SW2
  Bottom 0.254: C21.2 79.52,8.3 v80.9,8.3 81.3,8.7 v81.3,17.7
SW_R  (via drill 0.4)
  Top 0.254: TEENSY_3.2.14/A0 99.03,3.2 100.1,2.13 102.33,2.13 103.5,3.3 v103.5,5.95 v103.51,5.96
  Bottom 0.254: v103.51,5.96 v103.5,5.97 103.5,13.25 106.75,16.5 111.4,16.5 112.55,15.35 C16.2 114,16.65 ENC_R.SW2
SW_T  (via drill 0.4)
  Top 0.254: v82,24.47 72.22,24.47 71.25,23.5 68.33,23.5 66.3,25.53 57.97,25.53 v56.25,27.25
  Bottom 0.254: R17.1 C29.1 56.25,26.1 v56.25,27.25 | TEENSY_3.2.5 82,21.66 v82,24.47
TR1  (via drill 0.4)
  Top 0.254: v2.62,20.07 7.8,25.25 33.75,25.25 36.3,27.8 48.1,27.8 51.22,24.68 56.1,24.68 56.43,24.36 65.82,24.36 67.84,22.33 68.63,22.33 TEENSY_3.2.0
  Bottom 0.254: Q4.3 v2.61,20.08 v2.62,20.07
TR2  (via drill 0.4)
  Top 0.254: TEENSY_3.2.1 73.63,19.75 72.38,18.5 63.03,18.5 60.92,20.61 59.46,20.61 55.89,24.18 51.01,24.18 47.9,27.29 36.51,27.29 33.96,24.74 16.73,24.74 v11.87,19.88
  Bottom 0.254: Q3.3 v11.87,19.88
TR3  (via drill 0.4)
  Top 0.254: v21.14,19.57 25.8,24.23 34.17,24.23 36.72,26.78 47.68,26.78 54.37,20.1 60.71,20.1 62.82,17.99 74.29,17.99 TEENSY_3.2.2
  Bottom 0.254: Q2.3 21.14,22.79 v21.14,19.57
TR4  (via drill 0.4)
  Top 0.254: v28.75,22.75 29.73,23.73 34.38,23.73 36.93,26.28 47.47,26.28 54.16,19.59 60.5,19.59 62.61,17.48 76.32,17.48 TEENSY_3.2.3
  Bottom 0.254: Q1.3 v28.75,22.75
V_BIAS  (via drill 0.4)
  Top 0.254: v142.68,15.18 142.68,15 141.37,13.69 138.25,13.69 v137.56,13 137.5,13 | v124.25,3.25 127,6 127,12 128.33,13.33 134.01,13.33 134.84,14.16 136.34,14.16 137.5,13 | v141,2 138.75,2 137.5,3.25 137.5,13
  Bottom 0.254: R16.2 C15.1 | R14.1 114.05,9.8 C15.1 | v124.25,3.25 120.6,3.25 115.9,7.95 C15.1 | IC2.5 137.34,22.16 138.62,20.89 IC2.3 138.62,17.09 139,16.7 141.23,16.7 142.68,15.25 v142.68,15.18 | v137.56,13 137.5,12.94 137.5,10.21 IC1.5 | IC1.3 138.66,3.58 139.25,3 140.5,3 141,2.5 v141,2
VCC  (via drill 0.4, 0.5, 0.6)
  Top 0.305: v141.5,15.25 141.62,15.38 142.25,16 v142.25,25.25
  Top 0.508: 141.62,15.38 141.12,14.88 134.62,14.88 133.74,13.99 111.4,13.99 93.41,13.99 v91.1,16.3 | v67.9,7.1 v59.4,7.1 49.1,7.1 48.2,8 v48.25,8
  Bottom 0.254: v141.5,15.25 141.15,14.9 C7.1 141.21,12.85 IC1.8 | 141.1,26.75 C8.1 | 141.1,23.66 IC2.8
  Bottom 0.305: IC2.8 141.16,26.7 141.1,26.75 | C8.1 141.9,26.85 142.25,26.5 v142.25,25.25
  Bottom 0.406: 59.3,9.09 C4.+ v59.41,7.11 v59.4,7.1
  Bottom 0.508: U3.3 48.01,8.24 v48.25,8 48.37,8.12 D2.C | v67.9,7.1 68.6,6.4 81.6,6.4 88.31,13.11 C2.+ 91.13,16.27 v91.1,16.3
VEE  (via drill 0.4, 0.5, 0.6)
  Top 0.254: v133,12 133,6 135,4 v136,4
  Top 0.508: v133,15.75 132.75,15.75 131.75,14.75 96.9,14.75 v95.08,16.57 93.9,17.75 83.8,17.75 82.3,16.25 52.25,16.25 50.3,18.2 v50.3,21
  Bottom 0.254: C9.2 137.5,4.79 | 137.5,4.79 IC1.4 | v136,4 136.71,4 137.5,4.79 | C28.1 54.1,19.85 R18.1 54.05,20.75 53.8,21 v50.3,21
  Bottom 0.305: IC2.4 137.34,15.71 C10.2 136.7,14.75 134,14.75 v133,15.75 v133,12
  Bottom 0.508: C3.- 97.22,12.66 95.08,14.8 v95.08,16.57 | v50.3,21 50.11,21.19 D1.A
VREF_2V5  (via drill 0.4)
  Top 0.254: v118.25,16 118.44,15.81 v121,15.81
  Bottom 0.254: U1.3 124.09,14.1 123.75,13.75 121.75,13.75 121,14.5 v121,15.81 | C19.1 109.82,11.58 C18.1 R14.2 115.35,11.55 116.4,12.6 116.4,15.2 117.2,16 v118.25,16

### Text on the board
tPlace: 1uO_c | CC-BY-SA 4.0
bPlace: 1uO_c | v1.3, 8/2019 | Shay Shezifi (PLUM) | ORIGINAL O_C BY MXMXMX | CC BY-SA 4.0